# Altium schematic sheet FFT-K210.SchDoc
size A3
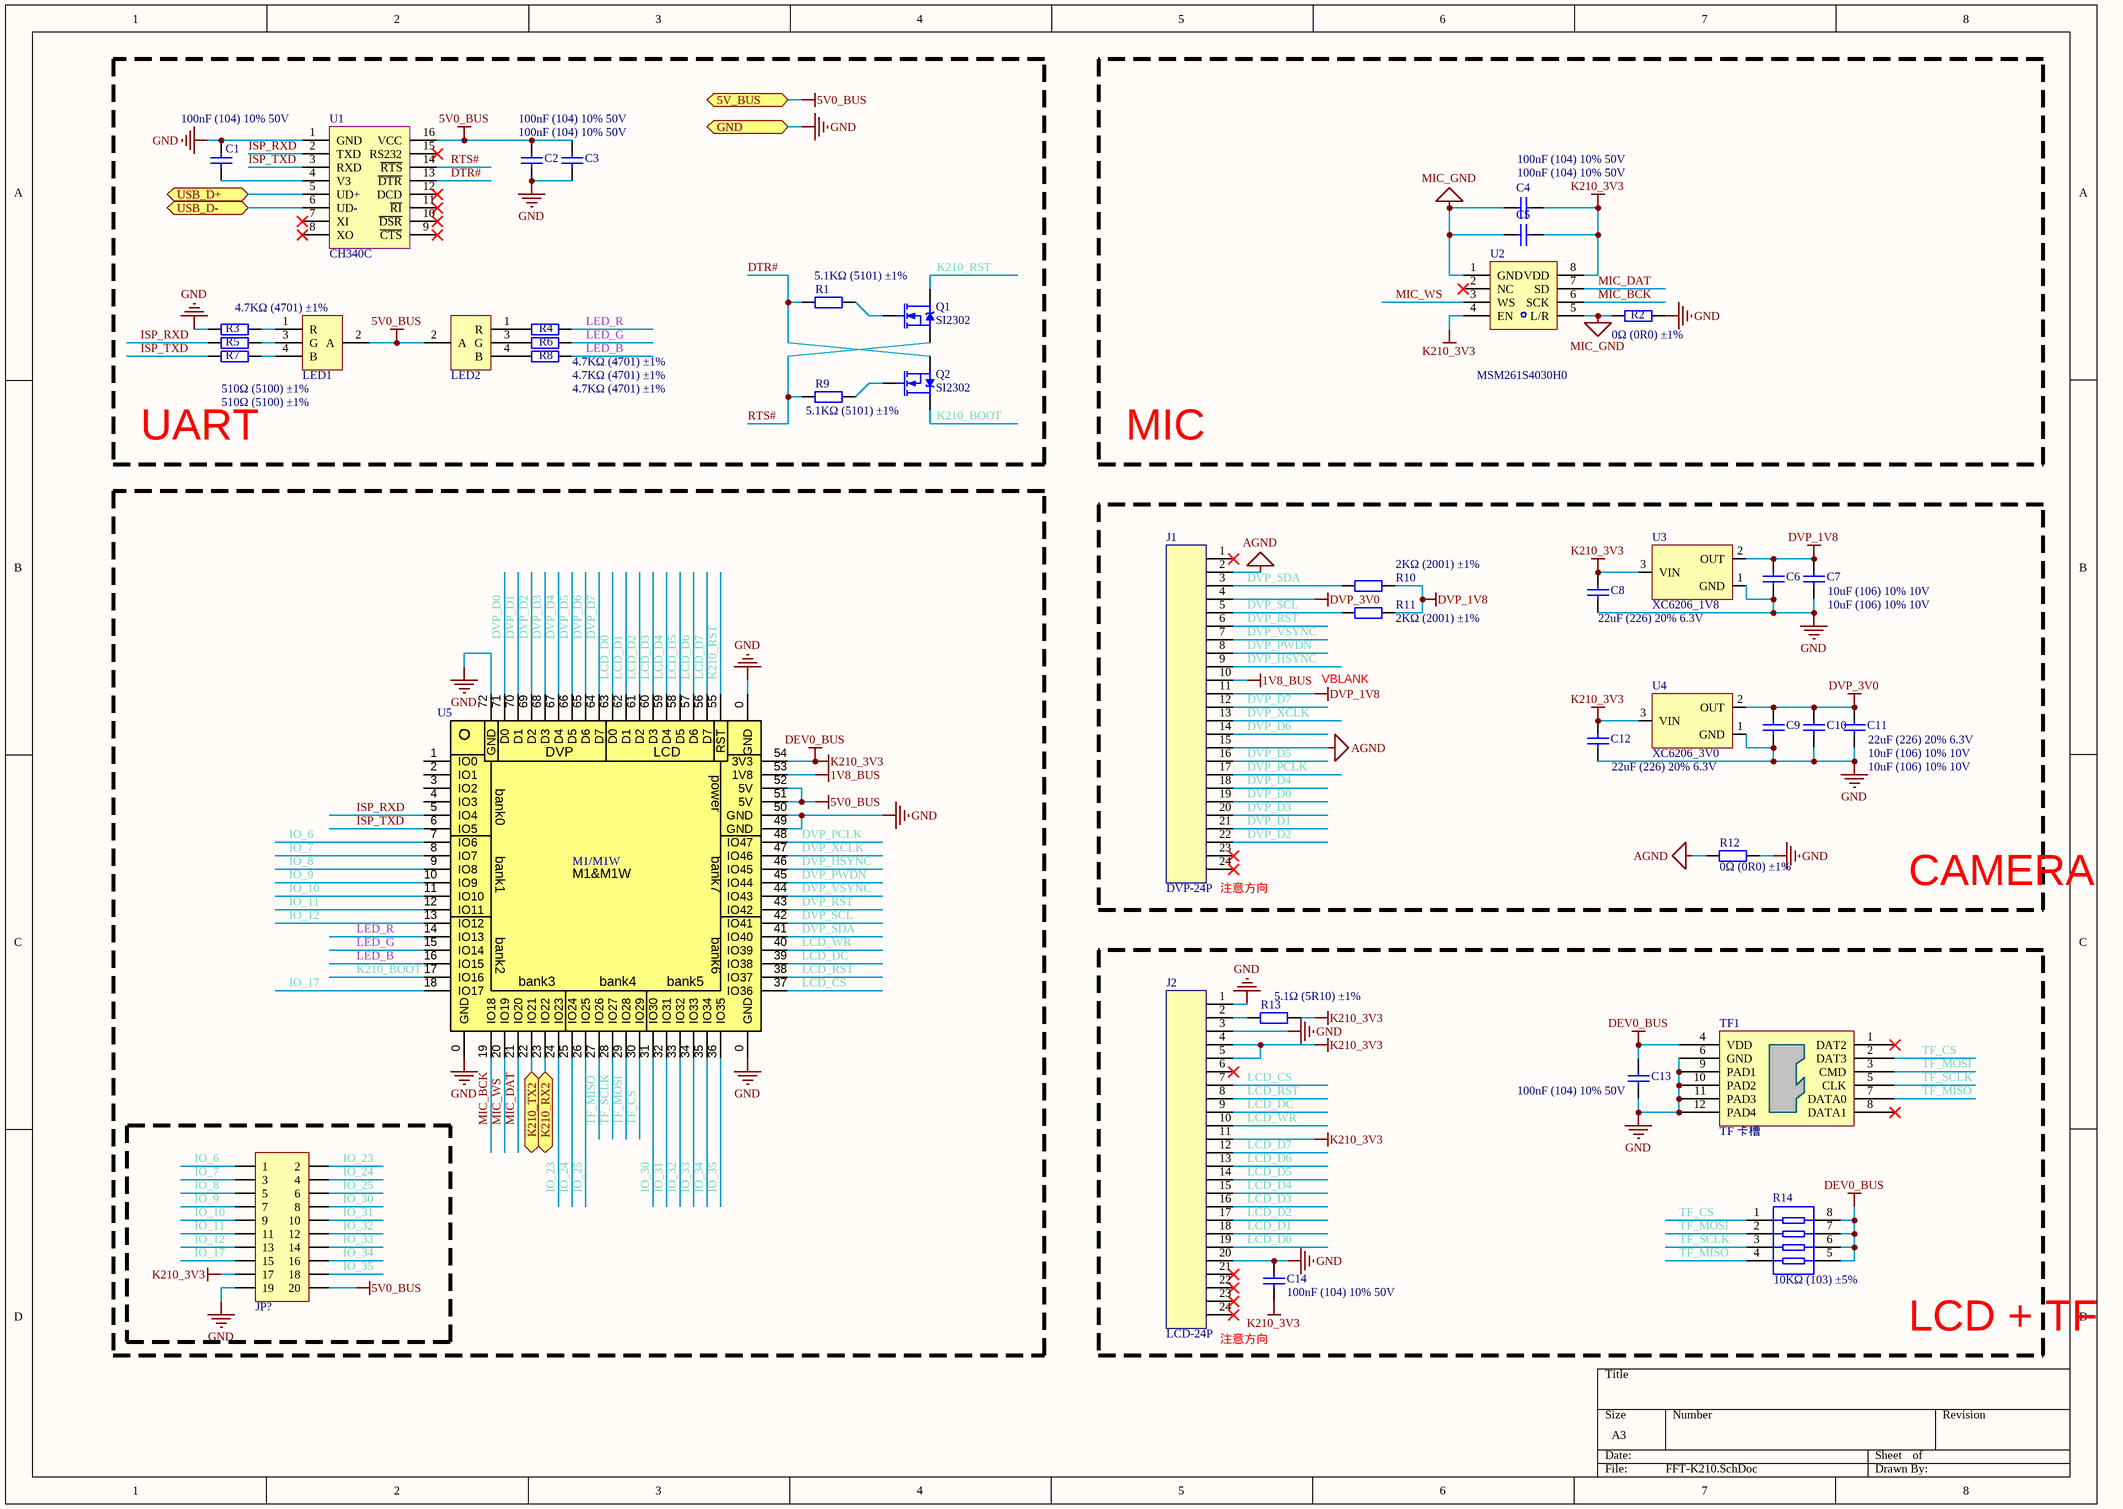
[diagram p0: FFT-K210.SchDoc]

## Parts
C1  100nF (104) 10% 50V  [LC-0603_C]
C2  100nF (104) 10% 50V  [LC-0603_C]
C3  100nF (104) 10% 50V  [LC-0603_C]
C4  100nF (104) 10% 50V  [LC-0603_C]
C5  100nF (104) 10% 50V  [LC-0603_C]
C6  10uF (106) 10% 10V  [LC-0603_C]
C7  10uF (106) 10% 10V  [LC-0603_C]
C8  22uF (226) 20% 6.3V  [LC-0603_C]
C9  22uF (226) 20% 6.3V  [LC-0603_C]
C10  10uF (106) 10% 10V  [LC-0603_C]
C11  10uF (106) 10% 10V  [LC-0603_C]
C12  22uF (226) 20% 6.3V  [LC-0603_C]
C13  100nF (104) 10% 50V  [LC-0603_C]
C14  100nF (104) 10% 50V  [LC-0603_C]
J1  DVP-24P  [FPC0.5-24P]
J2  LCD-24P  [FPC0.5-24P]
JP?  Header 2X10  [HDR2.54-LI-2x10P]  (value not drawn)
LED1  RGB  [RGB-16X16MM]  (value not drawn)
LED2  RGB  [RGB-16X16MM]  (value not drawn)
Q1  SI2302  [SOT23]
Q2  SI2302  [SOT23]
R1  5.1KΩ (5101) ±1%  [LC-0603_R]
R2  0Ω (0R0) ±1%  [LC-0603_R]
R3  4.7KΩ (4701) ±1%  [LC-0603_R]
R4  4.7KΩ (4701) ±1%  [LC-0603_R]
R5  510Ω (5100) ±1%  [LC-0603_R]
R6  4.7KΩ (4701) ±1%  [LC-0603_R]
R7  510Ω (5100) ±1%  [LC-0603_R]
R8  4.7KΩ (4701) ±1%  [LC-0603_R]
R9  5.1KΩ (5101) ±1%  [LC-0603_R]
R10  2KΩ (2001) ±1%  [LC-0603_R]
R11  2KΩ (2001) ±1%  [LC-0603_R]
R12  0Ω (0R0) ±1%  [LC-0603_R]
R13  5.1Ω (5R10) ±1%  [LC-0603_R]
R14  10KΩ (103) ±5%  [LC-0603_Rx4]
TF1  TF 卡槽  [TF-SOCKET]
U1  CH340C  [SOIC_16]
U2  MSM261S4030H0  [MSM-MIC]
U3  XC6206_1V8  [SOT23_3]
U4  XC6206_3V0  [SOT23_3]
U5  M1/M1W  [M1]

## Blocks framed on the sheet
UART: C1-C3 LED1 LED2 Q1 Q2 R1 R3-R9 U1
MIC: C4 C5 R2 U2
CAMERA: C6-C12 J1 R10-R12 U3 U4
LCD + TF: C13 C14 J2 R13 R14 TF1

## Ports
5V_BUS, GND, K210_RX2, K210_TX2, USB_D+, USB_D-

## Nets
1V8_BUS: J1.10 U5.53(1V8)
5V0_BUS: C2.2 C3.2 JP?.20 LED1.2(A) LED2.2(A) U1.16(VCC) U5.51(5V) U5.52(5V) ; port 5V_BUS
AGND: J1.2 J1.15 R12.1
DEV0_BUS: C4.1 C5.1 C8.2 C12.2 C13.2 C14.1 J2.4 J2.5 J2.11 JP?.17 R13.1 R14.5 R14.6 R14.7 R14.8 TF1.4(VDD) U2.4(EN) U2.8(VDD) U3.3(VIN) U4.3(VIN) U5.54(3V3)  [also labelled K210_3V3]
DVP_1V8: C6.2 C7.2 J1.11 R10.2 R11.2 U3.2(OUT)
DVP_3V0: C9.2 C10.2 C11.2 J1.4 U4.2(OUT)
GND: C1.1 C2.1 C3.1 C6.1 C7.1 C8.1 C9.1 C10.1 C11.1 C12.1 C13.1 C14.2 J2.1 J2.3 J2.20 JP?.19 R2.2 R3.1 R12.2 TF1.6(GND) TF1.9(PAD1) TF1.10(PAD2) TF1.11(PAD3) TF1.12(PAD4) U1.1(GND) U3.1(GND) U4.1(GND) U5.0(GND) U5.49(GND) U5.50(GND) U5.72(GND) ; port GND
MIC_GND: C4.2 C5.2 R2.1 U2.1(GND) U2.5(L/R)
DTR#: Q2.S R1.1 U1.13(~{DTR})
DVP_D0: J1.19 U5.71(D0)
DVP_D1: J1.21 U5.70(D1)
DVP_D2: J1.22 U5.69(D2)
DVP_D3: J1.20 U5.68(D3)
DVP_D4: J1.18 U5.67(D4)
DVP_D5: J1.16 U5.66(D5)
DVP_D6: J1.14 U5.65(D6)
DVP_D7: J1.12 U5.64(D7)
DVP_HSYNC: J1.9 U5.46(IO45)
DVP_PCLK: J1.17 U5.48(IO47)
DVP_PWDN: J1.8 U5.45(IO44)
DVP_RST: J1.6 U5.43(IO42)
DVP_SCL: J1.5 R11.1 U5.42(IO41)
DVP_SDA: J1.3 R10.1 U5.41(IO40)
DVP_VSYNC: J1.7 U5.44(IO43)
DVP_XCLK: J1.13 U5.47(IO46)
IO_6: JP?.1 U5.7(IO6)
IO_7: JP?.3 U5.8(IO7)
IO_8: JP?.5 U5.9(IO8)
IO_9: JP?.7 U5.10(IO9)
IO_10: JP?.9 U5.11(IO10)
IO_11: JP?.11 U5.12(IO11)
IO_12: JP?.13 U5.13(IO12)
IO_17: JP?.15 U5.18(IO17)
IO_23: JP?.2 U5.24(IO23)
IO_24: JP?.4 U5.25(IO24)
IO_25: JP?.6 U5.26(IO25)
IO_30: JP?.8 U5.31(IO30)
IO_31: JP?.10 U5.32(IO31)
IO_32: JP?.12 U5.33(IO32)
IO_33: JP?.14 U5.34(IO33)
IO_34: JP?.16 U5.35(IO34)
IO_35: JP?.18 U5.36(IO35)
ISP_RXD: R5.1 U1.2(TXD) U5.5(IO4)
ISP_TXD: R7.1 U1.3(RXD) U5.6(IO5)
K210_BOOT: Q2.D U5.17(IO16)
K210_RST: Q1.D U5.55(RST)
K210_RX2: U5.23(IO22) ; port K210_RX2
K210_TX2: U5.22(IO21) ; port K210_TX2
LCD_CS: J2.7 U5.37(IO36)
LCD_D0: J2.19 U5.63(D0)
LCD_D1: J2.18 U5.62(D1)
LCD_D2: J2.17 U5.61(D2)
LCD_D3: J2.16 U5.60(D3)
LCD_D4: J2.15 U5.59(D4)
LCD_D5: J2.14 U5.58(D5)
LCD_D6: J2.13 U5.57(D6)
LCD_D7: J2.12 U5.56(D7)
LCD_DC: J2.9 U5.39(IO38)
LCD_RST: J2.8 U5.38(IO37)
LCD_WR: J2.10 U5.40(IO39)
LED_B: R8.2 U5.16(IO15)
LED_G: R6.2 U5.15(IO14)
LED_R: R4.2 U5.14(IO13)
MIC_BCK: U2.6(SCK) U5.19(IO18)
MIC_DAT: U2.7(SD) U5.21(IO20)
MIC_WS: U2.3(WS) U5.20(IO19)
RTS#: Q1.S R9.1 U1.14(~{RTS})
TF_CS: R14.1 TF1.2(DAT3) U5.30(IO29)
TF_MISO: R14.4 TF1.7(DATA0) U5.27(IO26)
TF_MOSI: R14.2 TF1.3(CMD) U5.29(IO28)
TF_SCLK: R14.3 TF1.5(CLK) U5.28(IO27)
USB_D+: U1.5(UD+) ; port USB_D+
USB_D-: U1.6(UD-) ; port USB_D-
NetC1_2: C1.2 U1.4(V3)
NetJ2_2: J2.2 R13.2
NetLED1_1: LED1.1(R) R3.2
NetLED1_3: LED1.3(G) R5.2
NetLED1_4: LED1.4(B) R7.2
NetLED2_1: LED2.1(R) R4.1
NetLED2_3: LED2.3(G) R6.1
NetLED2_4: LED2.4(B) R8.1
NetQ1_G: Q1.G R1.2
NetQ2_G: Q2.G R9.2

Not connected (* = marked no-connect by the designer): J1 1* 23* 24*; J2 6* 21* 22* 23* 24*; TF1 1(DAT2)* 8(DATA1)*; U1 7(XI)* 8(XO)* 9(~{CTS})* 10(~{DSR})* 11(~{RI})* 12(DCD)* 15(RS232)*; U2 2(NC)*; U5 1(IO0) 2(IO1) 3(IO2) 4(IO3)

## Notes on the sheet
- VBLANK
- (near J1) 注意方向
- (near J2) 注意方向
- (in symbol K210-M1/M1W) DVP; LCD; power; bank0; bank1; bank7; M1&M1W; bank2; bank6; bank3; bank4; bank5

## Library data of the parts
C1-C5 C13 C14 = 0603 100nF (104) 10% 50V: 贴片电容; ComponentLink1Description: 供应商链接; ComponentLink1URL: http://www.szlcsc.com/product/details_15331.html; Package: 0603; Supplier: LC; SuppliersPartNumber: C14663
C6 C7 C10 C11 = 0603 10uF (106) 10% 10V: 贴片电容; ComponentLink1Description: 供应商链接; ComponentLink1URL: http://www.szlcsc.com/product/details_20411.html; Package: 0603; Supplier: LC; SuppliersPartNumber: C19702
C8 C9 C12 = 0603 22uF (226) 20% 6.3V: 贴片电容; ComponentLink1Description: 供应商链接; ComponentLink1URL: http://www.szlcsc.com/product/details_60514.html; Package: 0603; Supplier: LC; SuppliersPartNumber: C59461
J1 J2 = FPC0.5-24P: 贴片
JP? = Header 10X2: 10*2P接插件; 版权归属: 源创客; BOM名称: 10*2P接插件; 学习资源: www.ooocke.com
LED1 LED2 = RGB1616: RGB,SMD16x16mm
Q1 Q2 = N-MOS: N沟道场效应管
R1 R9 = 0603 5.1KΩ (5101) 1%: 贴片电阻; ComponentLink1Description: 供应商链接; ComponentLink1URL: http://www.szlcsc.com/product/details_23913.html; Package: 0603; Supplier: LC; SuppliersPartNumber: C23186
R2 R12 = 0603 0Ω (0R0) 1%: 贴片电阻; ComponentLink1Description: 供应商链接; ComponentLink1URL: http://www.szlcsc.com/product/details_21903.html; Package: 0603; Supplier: LC; SuppliersPartNumber: C21189
R3 R4 R6 R8 = 0603 4.7KΩ (4701) 1%: 贴片电阻; ComponentLink1Description: 供应商链接; ComponentLink1URL: http://www.szlcsc.com/product/details_23889.html; Package: 0603; Supplier: LC; SuppliersPartNumber: C23162
R5 R7 = 0603 510Ω (5100) 1%: 贴片电阻; ComponentLink1Description: 供应商链接; ComponentLink1URL: http://www.szlcsc.com/product/details_23920.html; Package: 0603; Supplier: LC; SuppliersPartNumber: C23193
R10 R11 = 0603 2KΩ (2001) 1%: 贴片电阻; ComponentLink1Description: 供应商链接; ComponentLink1URL: http://www.szlcsc.com/product/details_23702.html; Package: 0603; Supplier: LC; SuppliersPartNumber: C22975
R13 = 0603 5.1Ω (5R10) 1%: 贴片电阻; ComponentLink1Description: 供应商链接; ComponentLink1URL: http://www.szlcsc.com/product/details_25940.html; Package: 0603; Supplier: LC; SuppliersPartNumber: C25197
R14 = 0603*4  10KΩ (103) 5%: 贴片排阻; ComponentLink1Description: 供应商链接; ComponentLink1URL: http://www.szlcsc.com/product/details_30472.html; Package: 0603*4; Supplier: LC; SuppliersPartNumber: C29718
TF1 = TF CARD
U1 = CH340G
U2 = MSM261S4030H0: MSM硅麦克风
U3 U4 = XC6206: XC6206 LDO稳压器
U5 = K210-M1/M1W: K210核心件